# Altium project MyPro.PrjPCB
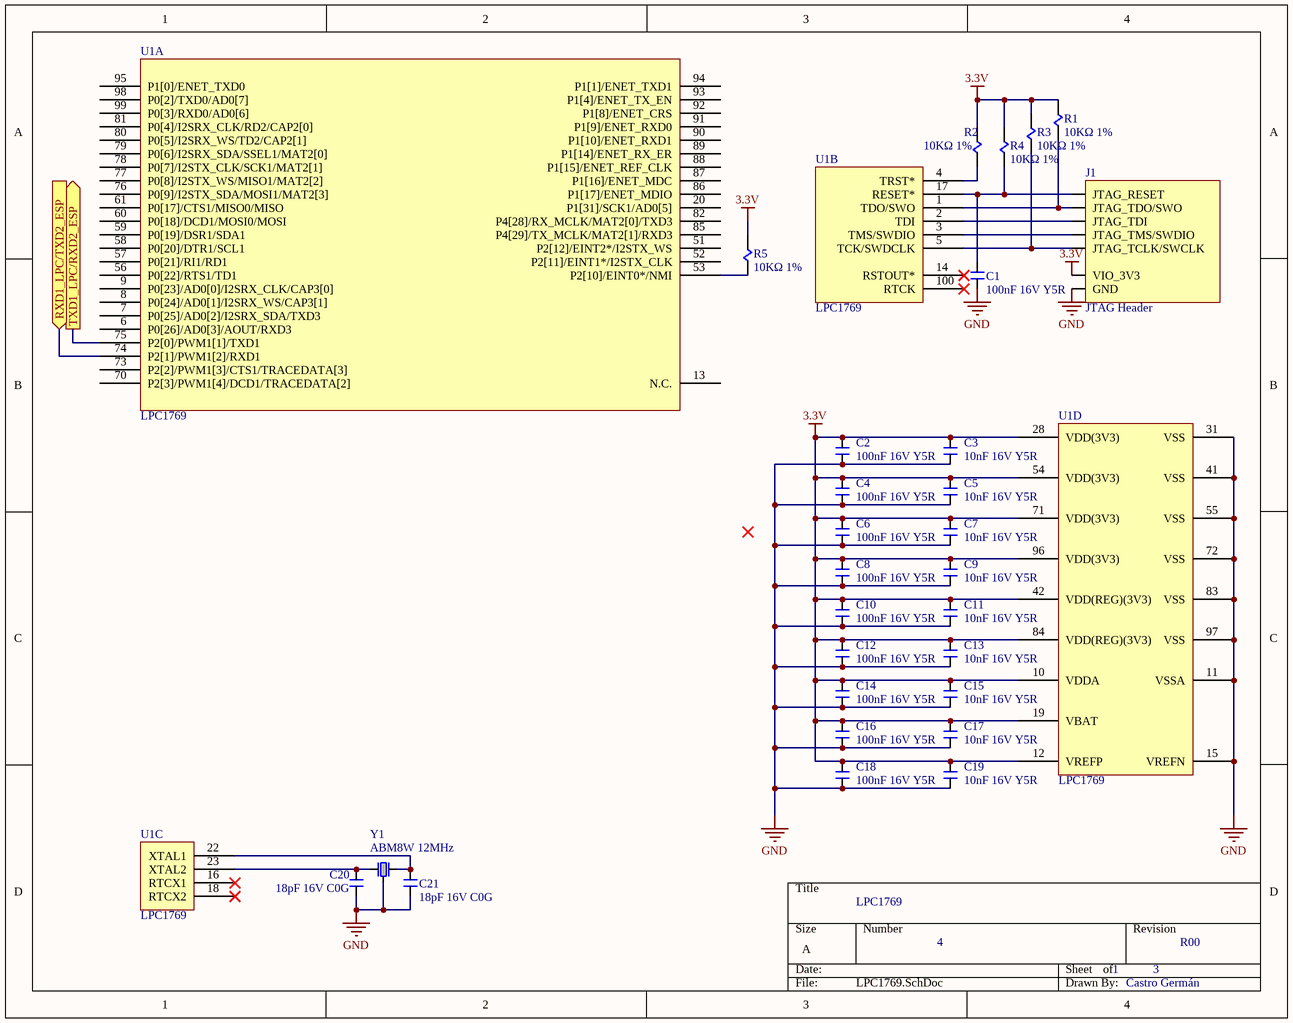
[diagram p0: LPC1769.SchDoc]
3 sheets, 76 parts. Net scope: flat (ports and power ports of the same name join across sheets).
Board file: MyPro.PcbDoc
Sheets:
  LPC1769.SchDoc
  ESP32WROOM.SchDoc
  Perifericos.SchDoc

## Sheet LPC1769.SchDoc: LPC1769
size A; DrawnBy: Castro Germán; Revision: R00; SheetNumber: 1; SheetTotal: 3

### Parts
C1  100nF 16V Y5R  [C_0805]
C2  100nF 16V Y5R  [C_0805]
C3  10nF 16V Y5R  [C_0805]
C4  100nF 16V Y5R  [C_0805]
C5  10nF 16V Y5R  [C_0805]
C6  100nF 16V Y5R  [C_0805]
C7  10nF 16V Y5R  [C_0805]
C8  100nF 16V Y5R  [C_0805]
C9  10nF 16V Y5R  [C_0805]
C10  100nF 16V Y5R  [C_0805]
C11  10nF 16V Y5R  [C_0805]
C12  100nF 16V Y5R  [C_0805]
C13  10nF 16V Y5R  [C_0805]
C14  100nF 16V Y5R  [C_0805]
C15  10nF 16V Y5R  [C_0805]
C16  100nF 16V Y5R  [C_0805]
C17  10nF 16V Y5R  [C_0805]
C18  100nF 16V Y5R  [C_0805]
C19  10nF 16V Y5R  [C_0805]
C20  18pF 16V C0G  [C_0805]
C21  18pF 16V C0G  [C_0805]
J1  JTAG Header
R1  10KΩ 1%  [R_0805]
R2  10KΩ 1%  [R_0805]
R3  10KΩ 1%  [R_0805]
R4  10KΩ 1%  [R_0805]
R5  10KΩ 1%  [R_0805]
U1  LPC1769  [LQFP100]  (parts A,B,C,D of 5)
Y1  ABM8W 12MHz  [ABM8W]

### Ports
RXD1_LPC/TXD2_ESP (in), TXD1_LPC/RXD2_ESP (out)

### Nets
3.3V: C2.1(A1) C3.1(A1) C4.1(A1) C5.1(A1) C6.1(A1) C7.1(A1) C8.1(A1) C9.1(A1) C10.1(A1) C11.1(A1) C12.1(A1) C13.1(A1) C14.1(A1) C15.1(A1) C16.1(A1) C17.1(A1) C18.1(A1) C19.1(A1) J1.1(VIO_3V3) R1.2(P2) R2.2(P2) R3.2(P2) R4.2(P2) R5.1(P1) U1.10(VDDA) U1.12(VREFP) U1.19(VBAT) U1.28(VDD(3V3)) U1.42(VDD(REG)(3V3)) U1.54(VDD(3V3)) U1.71(VDD(3V3)) U1.84(VDD(REG)(3V3)) U1.96(VDD(3V3))
GND: C1.2(A2) C2.2(A2) C3.2(A2) C4.2(A2) C5.2(A2) C6.2(A2) C7.2(A2) C8.2(A2) C9.2(A2) C10.2(A2) C11.2(A2) C12.2(A2) C13.2(A2) C14.2(A2) C15.2(A2) C16.2(A2) C17.2(A2) C18.2(A2) C19.2(A2) C20.2(A2) C21.2(A2) J1.8(GND) U1.11(VSSA) U1.15(VREFN) U1.31(VSS) U1.41(VSS) U1.55(VSS) U1.72(VSS) U1.83(VSS) U1.97(VSS) Y1.3(P3)
NetC1_1: C1.1(A1) J1.6(JTAG_RESET) R4.1(P1) U1.17(RESET*)
NetC20_1: C20.1(A1) U1.23(XTAL2) Y1.1(P1)
NetC21_1: C21.1(A1) U1.22(XTAL1) Y1.2(P2)
NetJ1_2: J1.2(JTAG_TMS/SWDIO) U1.3(TMS/SWDIO)
NetJ1_3: J1.3(JTAG_TCLK/SWCLK) R3.1(P1) U1.5(TCK/SWDCLK)
NetJ1_4: J1.4(JTAG_TDO/SWO) R1.1(P1) U1.1(TDO/SWO)
NetJ1_5: J1.5(JTAG_TDI) U1.2(TDI)
NetR2_1: R2.1(P1) U1.4(TRST*)
NetR5_2: R5.2(P2) U1.53(P2[10]/EINT0*/NMI)
NetU1_74: U1.74(P2[1]/PWM1[2]/RXD1) ; port RXD1_LPC/TXD2_ESP
NetU1_75: U1.75(P2[0]/PWM1[1]/TXD1) ; port TXD1_LPC/RXD2_ESP

Not connected (* = marked no-connect by the designer): U1 6(P0[26]/AD0[3]/AOUT/RXD3) 7(P0[25]/AD0[2]/I2SRX_SDA/TXD3) 8(P0[24]/AD0[1]/I2SRX_WS/CAP3[1]) 9(P0[23]/AD0[0]/I2SRX_CLK/CAP3[0]) 13(N.C.) 14(RSTOUT*)* 16(RTCX1)* 18(RTCX2)* 20(P1[31]/SCK1/AD0[5]) 51(P2[12]/EINT2*/I2STX_WS) 52(P2[11]/EINT1*/I2STX_CLK) 56(P0[22]/RTS1/TD1) 57(P0[21]/RI1/RD1) 58(P0[20]/DTR1/SCL1) 59(P0[19]/DSR1/SDA1) 60(P0[18]/DCD1/MOSI0/MOSI) 61(P0[17]/CTS1/MISO0/MISO) 70(P2[3]/PWM1[4]/DCD1/TRACEDATA[2]) 73(P2[2]/PWM1[3]/CTS1/TRACEDATA[3]) 76(P0[9]/I2STX_SDA/MOSI1/MAT2[3]) 77(P0[8]/I2STX_WS/MISO1/MAT2[2]) 78(P0[7]/I2STX_CLK/SCK1/MAT2[1]) 79(P0[6]/I2SRX_SDA/SSEL1/MAT2[0]) 80(P0[5]/I2SRX_WS/TD2/CAP2[1]) 81(P0[4]/I2SRX_CLK/RD2/CAP2[0]) 82(P4[28]/RX_MCLK/MAT2[0]/TXD3) 85(P4[29]/TX_MCLK/MAT2[1]/RXD3) 86(P1[17]/ENET_MDIO) 87(P1[16]/ENET_MDC) 88(P1[15]/ENET_REF_CLK) 89(P1[14]/ENET_RX_ER) 90(P1[10]/ENET_RXD1) 91(P1[9]/ENET_RXD0) 92(P1[8]/ENET_CRS) 93(P1[4]/ENET_TX_EN) 94(P1[1]/ENET_TXD1) 95(P1[0]/ENET_TXD0) 98(P0[2]/TXD0/AD0[7]) 99(P0[3]/RXD0/AD0[6]) 100(RTCK)*

### Notes on the sheet
- 4

### Library data of the parts
C1-C21 = Capacitor
R1-R5 = Resistor
U1 = LPC1769: 32 bit ARM Cortex M3
Y1 = Crystal

## Sheet ESP32WROOM.SchDoc: ESP32WROOM
size A; DrawnBy: Castro Germán; Revision: R00; SheetNumber: 2; SheetTotal: 3
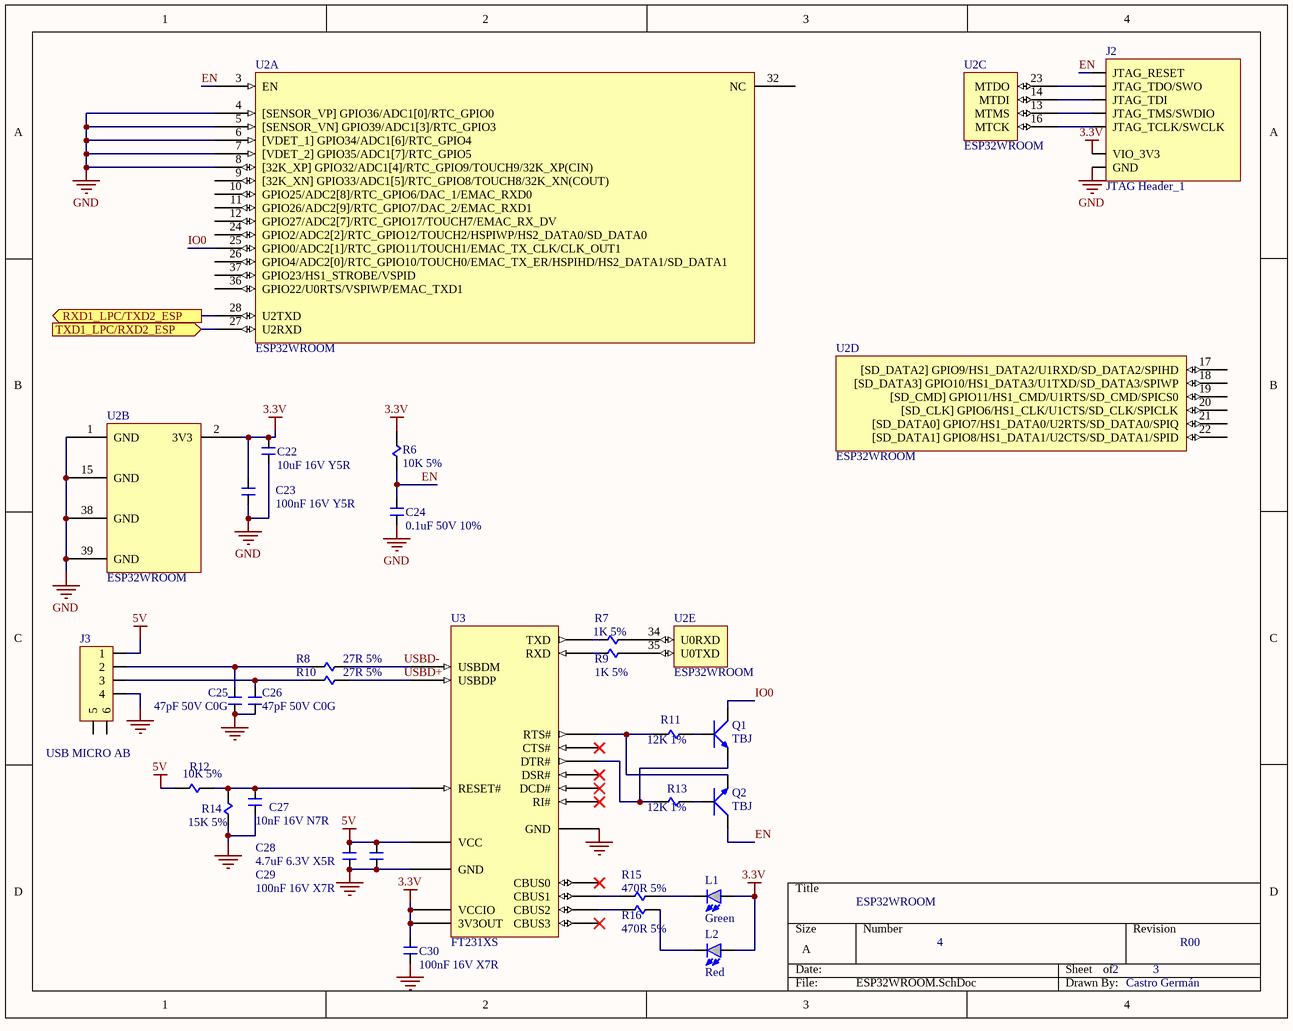
[diagram p1: ESP32WROOM.SchDoc]

### Parts
C22  10uF 16V Y5R  [C_0805]
C23  100nF 16V Y5R  [C_0805]
C24  0.1uF 50V 10%  [C_0805]
C25  47pF 50V C0G  [C_0805]
C26  47pF 50V C0G  [C_0805]
C27  10nF 16V N7R  [C_0805]
C28  4.7uF 6.3V X5R  [C_0805]
C29  100nF 16V X7R  [C_0805]
C30  100nF 16V X7R  [C_0805]
J2  JTAG Header_1  [HDRM_2.54mm_1X8]
J3  USB MICRO AB  [USB_MICRO_F_AB]
L1  Green  [Led_0805]
L2  Red  [Led_0805]
Q1  TBJ  [SOT-23]
Q2  TBJ  [SOT-23]
R6  10K 5%  [R_0805]
R7  1K 5%  [R_0805]
R8  27R 5%  [R_0805]
R9  1K 5%  [R_0805]
R10  27R 5%  [R_0805]
R11  12K 1%  [R_0805]
R12  10K 5%  [R_0805]
R13  12K 1%  [R_0805]
R14  15K 5%  [R_0805]
R15  470R 5%  [R_0805]
R16  470R 5%  [R_0805]
U2  ESP32WROOM  [ESP32_WROOM - duplicate]  (parts A,B,C,D,E of 6)
U3  FT231XS  [SSOP_20]

### Ports
RXD1_LPC/TXD2_ESP (out), TXD1_LPC/RXD2_ESP (in)

### Nets
3.3V: C22.1(A1) C23.1(A1) C30.1(A1) J2.1(VIO_3V3) L1.1(A) L2.1(A) R6.2(P2) U2.2(3V3) U3.3(VCCIO) U3.13(3V3OUT)
5V: C28.1(A1) C29.1(A1) J3.1 R12.1(P1) U3.15(VCC)
GND: C22.2(A2) C23.2(A2) C24.2(A2) C25.2(A2) C26.2(A2) C27.2(A2) C28.2(A2) C29.2(A2) C30.2(A2) J2.3(GND) J3.4 R14.2(P2) U2.1(GND) U2.4([SENSOR_VP]_GPIO36/ADC1[0]/RTC_GPIO0) U2.5([SENSOR_VN]_GPIO39/ADC1[3]/RTC_GPIO3) U2.6([VDET_1]_GPIO34/ADC1[6]/RTC_GPIO4) U2.7([VDET_2]_GPIO35/ADC1[7]/RTC_GPIO5) U2.8([32K_XP]_GPIO32/ADC1[4]/RTC_GPIO9/TOUCH9/32K_XP(CIN)) U2.15(GND) U2.38(GND) U2.39(GND) U3.6(GND) U3.16(GND)
EN: C24.1(A1) J2.4(JTAG_RESET) Q2.3(C) R6.1(P1) U2.3(EN)
IO0: Q1.3(C) U2.25(GPIO0/ADC2[1]/RTC_GPIO11/TOUCH1/EMAC_TX_CLK/CLK_OUT1)
USBD+: R10.2(P2) U3.11(USBDP)
USBD-: R8.2(P2) U3.12(USBDM)
NetC25_1: C25.1(A1) J3.2 R8.1(P1)
NetC26_1: C26.1(A1) J3.3 R10.1(P1)
NetC27_1: C27.1(A1) R12.2(P2) R14.1(P1) U3.14(RESET#)
NetJ2_5: J2.5(JTAG_TMS/SWDIO) U2.13(MTMS)
NetJ2_6: J2.6(JTAG_TDI) U2.14(MTDI)
NetJ2_7: J2.7(JTAG_TCLK/SWCLK) U2.16(MTCK)
NetJ2_8: J2.8(JTAG_TDO/SWO) U2.23(MTDO)
NetL1_2: L1.2(K) R15.2(P2)
NetL2_2: L2.2(K) R16.2(P2)
NetQ1_1: Q1.1(B) R11.2(P2)
NetQ1_2: Q1.2(E) R13.1(P1) U3.1(DTR#)
NetQ2_1: Q2.1(B) R13.2(P2)
NetQ2_2: Q2.2(E) R11.1(P1) U3.2(RTS#)
NetR7_1: R7.1(P1) U3.20(TXD)
NetR7_2: R7.2(P2) U2.34(U0RXD)
NetR9_1: R9.1(P1) U3.4(RXD)
NetR9_2: R9.2(P2) U2.35(U0TXD)
NetR15_1: R15.1(P1) U3.17(CBUS1)
NetR16_1: R16.1(P1) U3.10(CBUS2)
NetU1_74: U2.28(U2TXD) ; port RXD1_LPC/TXD2_ESP
NetU1_75: U2.27(U2RXD) ; port TXD1_LPC/RXD2_ESP

Not connected (* = marked no-connect by the designer): J3 5 6; U2 9([32K_XN]_GPIO33/ADC1[5]/RTC_GPIO8/TOUCH8/32K_XN(COUT)) 10(GPIO25/ADC2[8]/RTC_GPIO6/DAC_1/EMAC_RXD0) 11(GPIO26/ADC2[9]/RTC_GPIO7/DAC_2/EMAC_RXD1) 12(GPIO27/ADC2[7]/RTC_GPIO17/TOUCH7/EMAC_RX_DV) 17([SD_DATA2]_GPIO9/HS1_DATA2/U1RXD/SD_DATA2/SPIHD) 18([SD_DATA3]_GPIO10/HS1_DATA3/U1TXD/SD_DATA3/SPIWP) 19([SD_CMD]_GPIO11/HS1_CMD/U1RTS/SD_CMD/SPICS0) 20([SD_CLK]_GPIO6/HS1_CLK/U1CTS/SD_CLK/SPICLK) 21([SD_DATA0]_GPIO7/HS1_DATA0/U2RTS/SD_DATA0/SPIQ) 22([SD_DATA1]_GPIO8/HS1_DATA1/U2CTS/SD_DATA1/SPID) 24(GPIO2/ADC2[2]/RTC_GPIO12/TOUCH2/HSPIWP/HS2_DATA0/SD_DATA0) 26(GPIO4/ADC2[0]/RTC_GPIO10/TOUCH0/EMAC_TX_ER/HSPIHD/HS2_DATA1/SD_DATA1) 32(NC) 36(GPIO22/U0RTS/VSPIWP/EMAC_TXD1) 37(GPIO23/HS1_STROBE/VSPID); U3 5(RI#)* 7(DSR#)* 8(DCD#)* 9(CTS#)* 18(CBUS0)* 19(CBUS3)*

### Notes on the sheet
- 4

### Library data of the parts
C22-C30 = Capacitor
J3 = Connectorx6: Parameter 1: 0480370001
L1 = Led_G: Green LED
L2 = Led_R: Red LED
Q1 Q2 = TBJ_NPN
R6-R16 = Resistor

## Sheet Perifericos.SchDoc: External Plugs
size A; DrawnBy: Castro Germán; Revision: R00; SheetNumber: 3; SheetTotal: 3
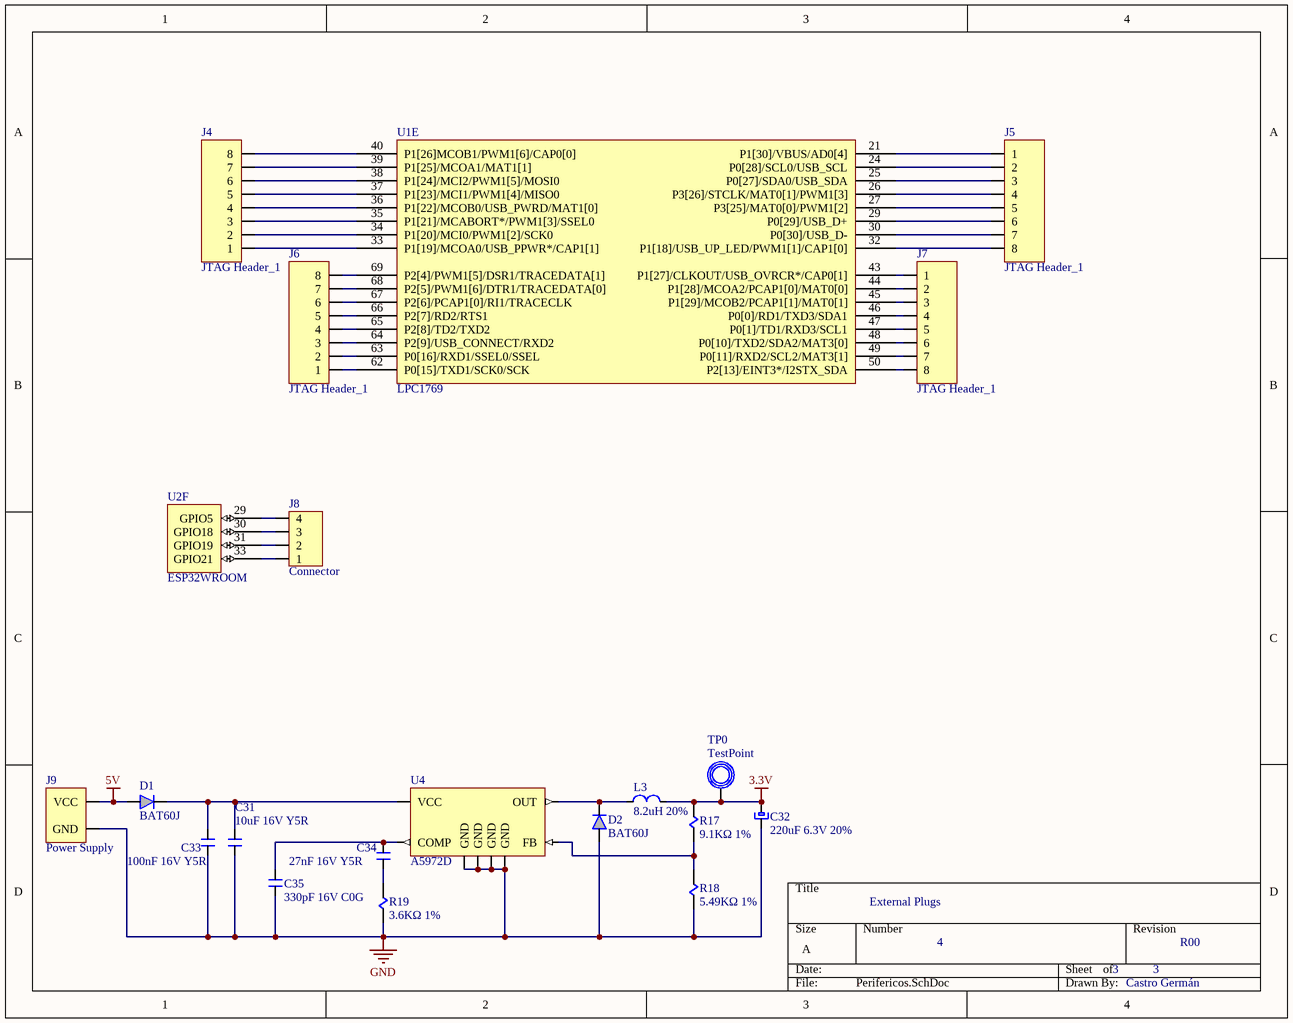
[diagram p2: Perifericos.SchDoc]

### Parts
C31  10uF 16V Y5R  [C_0805]
C32  220uF 6.3V 20%  [CT_2917_D]
C33  100nF 16V Y5R  [C_0805]
C34  27nF 16V Y5R  [C_0805]
C35  330pF 16V C0G  [C_0805]
D1  BAT60J  [SOD323]
D2  BAT60J  [SOD323]
J4  JTAG Header_1  [HDRM_2.54mm_1X8]
J5  JTAG Header_1  [HDRM_2.54mm_1X8]
J6  JTAG Header_1  [HDRM_2.54mm_1X8]
J7  JTAG Header_1  [HDRM_2.54mm_1X8]
J8  Connector  [HDRM_0.1_1X4]
J9  Power Supply  [HDRM_0.1_1x2]
L3  8.2uH 20%  [1R5_1710]
R17  9.1KΩ 1%  [R_0805]
R18  5.49KΩ 1%  [R_0805]
R19  3.6KΩ 1%  [R_0805]
TP0  TestPoint  [TestPoint]
U1  LPC1769  [LQFP100]  (part E of 5)
U2  ESP32WROOM  [ESP32_WROOM - duplicate]  (part F of 6)
U4  A5972D  [SO_8]

### Nets
3.3V: C32.1(P) L3.2(P2) R17.2(P2) TP0.1
5V: D1.1(A) J9.1(VCC)
GND: C31.2(A2) C32.2(N) C33.2(A2) C35.2(A2) D2.1(A) J9.2(GND) R18.1(P1) R19.1(P1) U4.2(GND) U4.3(GND) U4.6(GND) U4.7(GND)
NetC31_1: C31.1(A1) C33.1(A1) D1.2(K) U4.8(VCC)
NetC34_1: C34.1(A1) C35.1(A1) U4.4(COMP)
NetC34_2: C34.2(A2) R19.2(P2)
NetD2_2: D2.2(K) L3.1(P1) U4.1(OUT)
NetJ4_1: J4.1 U1.33(P1[19]/MCOA0/USB_PPWR*/CAP1[1])
NetJ4_2: J4.2 U1.34(P1[20]/MCI0/PWM1[2]/SCK0)
NetJ4_3: J4.3 U1.35(P1[21]/MCABORT*/PWM1[3]/SSEL0)
NetJ4_4: J4.4 U1.36(P1[22]/MCOB0/USB_PWRD/MAT1[0])
NetJ4_5: J4.5 U1.37(P1[23]/MCI1/PWM1[4]/MISO0)
NetJ4_6: J4.6 U1.38(P1[24]/MCI2/PWM1[5]/MOSI0)
NetJ4_7: J4.7 U1.39(P1[25]/MCOA1/MAT1[1])
NetJ4_8: J4.8 U1.40(P1[26]MCOB1/PWM1[6]/CAP0[0])
NetJ5_1: J5.1 U1.21(P1[30]/VBUS/AD0[4])
NetJ5_2: J5.2 U1.24(P0[28]/SCL0/USB_SCL)
NetJ5_3: J5.3 U1.25(P0[27]/SDA0/USB_SDA)
NetJ5_4: J5.4 U1.26(P3[26]/STCLK/MAT0[1]/PWM1[3])
NetJ5_5: J5.5 U1.27(P3[25]/MAT0[0]/PWM1[2])
NetJ5_6: J5.6 U1.29(P0[29]/USB_D+)
NetJ5_7: J5.7 U1.30(P0[30]/USB_D-)
NetJ5_8: J5.8 U1.32(P1[18]/USB_UP_LED/PWM1[1]/CAP1[0])
NetJ6_1: J6.1 U1.62(P0[15]/TXD1/SCK0/SCK)
NetJ6_2: J6.2 U1.63(P0[16]/RXD1/SSEL0/SSEL)
NetJ6_3: J6.3 U1.64(P2[9]/USB_CONNECT/RXD2)
NetJ6_4: J6.4 U1.65(P2[8]/TD2/TXD2)
NetJ6_5: J6.5 U1.66(P2[7]/RD2/RTS1)
NetJ6_6: J6.6 U1.67(P2[6]/PCAP1[0]/RI1/TRACECLK)
NetJ6_7: J6.7 U1.68(P2[5]/PWM1[6]/DTR1/TRACEDATA[0])
NetJ6_8: J6.8 U1.69(P2[4]/PWM1[5]/DSR1/TRACEDATA[1])
NetJ7_1: J7.1 U1.43(P1[27]/CLKOUT/USB_OVRCR*/CAP0[1])
NetJ7_2: J7.2 U1.44(P1[28]/MCOA2/PCAP1[0]/MAT0[0])
NetJ7_3: J7.3 U1.45(P1[29]/MCOB2/PCAP1[1]/MAT0[1])
NetJ7_4: J7.4 U1.46(P0[0]/RD1/TXD3/SDA1)
NetJ7_5: J7.5 U1.47(P0[1]/TD1/RXD3/SCL1)
NetJ7_6: J7.6 U1.48(P0[10]/TXD2/SDA2/MAT3[0])
NetJ7_7: J7.7 U1.49(P0[11]/RXD2/SCL2/MAT3[1])
NetJ7_8: J7.8 U1.50(P2[13]/EINT3*/I2STX_SDA)
NetJ8_1: J8.1 U2.33(GPIO21)
NetJ8_2: J8.2 U2.31(GPIO19)
NetJ8_3: J8.3 U2.30(GPIO18)
NetJ8_4: J8.4 U2.29(GPIO5)
NetR17_1: R17.1(P1) R18.2(P2) U4.5(FB)

### Notes on the sheet
- 4

### Library data of the parts
C31 C33-C35 = Capacitor
C32 = Polarized Capacitor
D1 D2 = Diode: Generic Diode
J4-J7 = Connector1x8
J8 = Connectorx4
J9 = Power Connector
L3 = Inductor
R17-R19 = Resistor
U1 = LPC1769: 32 bit ARM Cortex M3
U4 = A5972D: Fuente Switching 3.3v 1.5A

## Nets that join several sheets
3.3V: LPC1769 (33 pins), ESP32WROOM (10 pins), Perifericos (C32.1 L3.2 R17.2 TP0.1)
5V: ESP32WROOM (5 pins), Perifericos (D1.1 J9.1)
GND: LPC1769 (31 pins), ESP32WROOM (23 pins), Perifericos (12 pins)
NetU1_74: LPC1769 (U1.74), ESP32WROOM (U2.28)
NetU1_75: LPC1769 (U1.75), ESP32WROOM (U2.27)